# Altium schematic sheet ABS_ENC_IF.SchDoc
size 420 x 297 mm; SheetNumber: 4; PageSetup: Record=PageOptions|CenterHorizontal=False|CenterVertical=False|PrintScale=0.95|XCorrection=0.00|YCorrection=0.00|PrintKind=1|BorderSize=5000000|LeftOffset=0|BottomOffset=0|Orientation=1|PaperLength=1000|PaperWidth=1000|Scale=100|PaperSource=15|PrintQuality=600|MediaType=1|DitherType=10|PaperKind=A4|PrintScaleMode=1
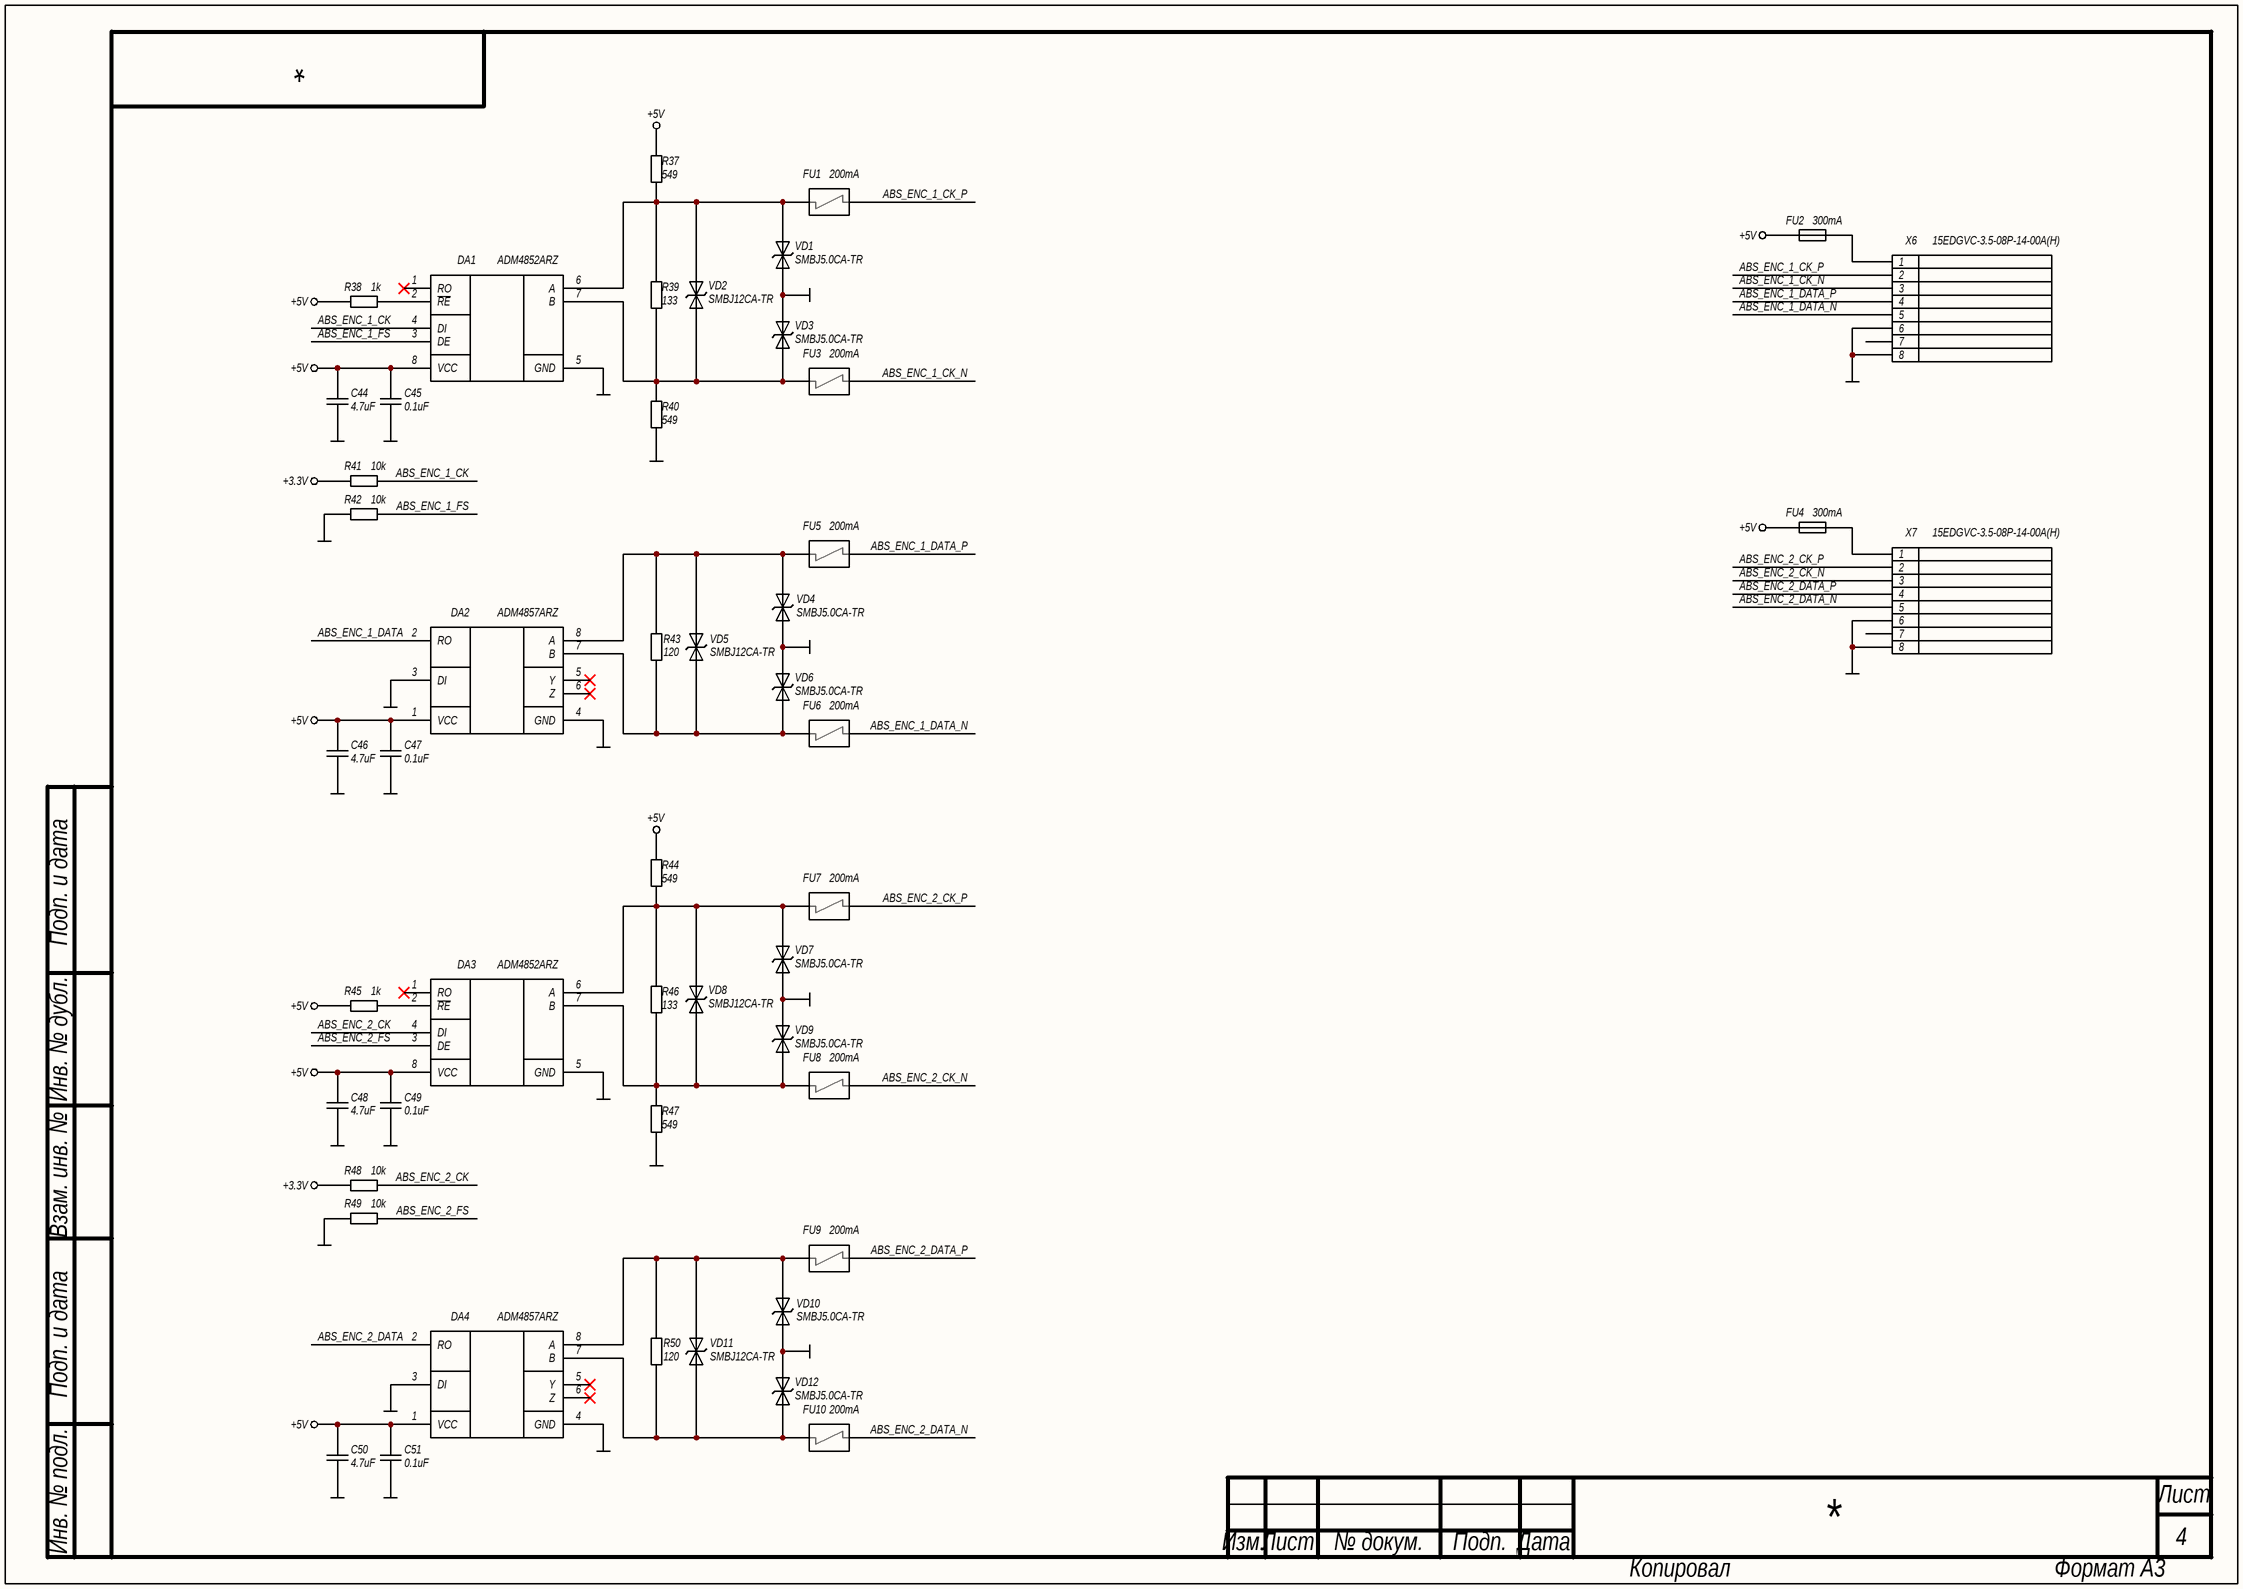
[diagram p0: ABS_ENC_IF.SchDoc]

## Parts
C44  4.7uF  [C0603N]
C45  0.1uF  [C0603N]
C46  4.7uF  [C0603N]
C47  0.1uF  [C0603N]
C48  4.7uF  [C0603N]
C49  0.1uF  [C0603N]
C50  4.7uF  [C0603N]
C51  0.1uF  [C0603N]
DA1  ADM4852ARZ  [SOIC8]
DA2  ADM4857ARZ  [SOIC8]
DA3  ADM4852ARZ  [SOIC8]
DA4  ADM4857ARZ  [SOIC8]
FU1  200mA  [TBU-CA]
FU2  300mA  [MF-MSMF]
FU3  200mA  [TBU-CA]
FU4  300mA  [MF-MSMF]
FU5  200mA  [TBU-CA]
FU6  200mA  [TBU-CA]
FU7  200mA  [TBU-CA]
FU8  200mA  [TBU-CA]
FU9  200mA  [TBU-CA]
FU10  200mA  [TBU-CA]
R37  549  [R0805N]
R38  1k  [R0603N]
R39  133  [R0805N]
R40  549  [R0805N]
R41  10k  [R0603N]
R42  10k  [R0603N]
R43  120  [R0805N]
R44  549  [R0805N]
R45  1k  [R0603N]
R46  133  [R0805N]
R47  549  [R0805N]
R48  10k  [R0603N]
R49  10k  [R0603N]
R50  120  [R0805N]
VD1  SMBJ5.0CA-TR  [SMB]
VD2  SMBJ12CA-TR  [SMB]
VD3  SMBJ5.0CA-TR  [SMB]
VD4  SMBJ5.0CA-TR  [SMB]
VD5  SMBJ12CA-TR  [SMB]
VD6  SMBJ5.0CA-TR  [SMB]
VD7  SMBJ5.0CA-TR  [SMB]
VD8  SMBJ12CA-TR  [SMB]
VD9  SMBJ5.0CA-TR  [SMB]
VD10  SMBJ5.0CA-TR  [SMB]
VD11  SMBJ12CA-TR  [SMB]
VD12  SMBJ5.0CA-TR  [SMB]
X6  15EDGVC-3.5-08P-14-00A(H)  [15EDGVC-3.5-08P-14-00A(H)]
X7  15EDGVC-3.5-08P-14-00A(H)  [15EDGVC-3.5-08P-14-00A(H)]

## Nets
+3.3V: R41.2 R48.2
+5V: C44.2 C45.2 C46.2 C47.2 C48.2 C49.2 C50.2 C51.2 DA1.8(VCC) DA2.1(VCC) DA3.8(VCC) DA4.1(VCC) FU2.1 FU4.1 R37.2 R38.2 R44.2 R45.2
GND: C44.1 C45.1 C46.1 C47.1 C48.1 C49.1 C50.1 C51.1 DA1.5(GND) DA2.3(DI) DA2.4(GND) DA3.5(GND) DA4.3(DI) DA4.4(GND) R40.1 R42.2 R47.1 R49.2 VD1.2(A2) VD3.2(A2) VD4.2(A2) VD6.2(A2) VD7.2(A2) VD9.2(A2) VD10.2(A2) VD12.2(A2) X6.6 X6.8 X7.6 X7.8
ABS_ENC_1_CK: DA1.4(DI) R41.1
ABS_ENC_1_CK_N: FU3.3(IN/OUT) X6.3
ABS_ENC_1_CK_P: FU1.3(IN/OUT) X6.2
ABS_ENC_1_DATA: DA2.2(RO)
ABS_ENC_1_DATA_N: FU6.3(IN/OUT) X6.5
ABS_ENC_1_DATA_P: FU5.3(IN/OUT) X6.4
ABS_ENC_1_FS: DA1.3(DE) R42.1
ABS_ENC_2_CK: DA3.4(DI) R48.1
ABS_ENC_2_CK_N: FU8.3(IN/OUT) X7.3
ABS_ENC_2_CK_P: FU7.3(IN/OUT) X7.2
ABS_ENC_2_DATA: DA4.2(RO)
ABS_ENC_2_DATA_N: FU10.3(IN/OUT) X7.5
ABS_ENC_2_DATA_P: FU9.3(IN/OUT) X7.4
ABS_ENC_2_FS: DA3.3(DE) R49.1
NetDA1_2: DA1.2(~{RE}) R38.1
NetDA1_6: DA1.6(A) FU1.1(IN/OUT) R37.1 R39.2 VD1.1(A1) VD2.1(A1)
NetDA1_7: DA1.7(B) FU3.1(IN/OUT) R39.1 R40.2 VD2.2(A2) VD3.1(A1)
NetDA2_7: DA2.7(B) FU6.1(IN/OUT) R43.2 VD5.2(A2) VD6.1(A1)
NetDA2_8: DA2.8(A) FU5.1(IN/OUT) R43.1 VD4.1(A1) VD5.1(A1)
NetDA3_2: DA3.2(~{RE}) R45.1
NetDA3_6: DA3.6(A) FU7.1(IN/OUT) R44.1 R46.2 VD7.1(A1) VD8.1(A1)
NetDA3_7: DA3.7(B) FU8.1(IN/OUT) R46.1 R47.2 VD8.2(A2) VD9.1(A1)
NetDA4_7: DA4.7(B) FU10.1(IN/OUT) R50.2 VD11.2(A2) VD12.1(A1)
NetDA4_8: DA4.8(A) FU9.1(IN/OUT) R50.1 VD10.1(A1) VD11.1(A1)
NetFU2_2: FU2.2 X6.1
NetFU4_2: FU4.2 X7.1

Not connected (* = marked no-connect by the designer): DA1 1(RO)*; DA2 5(Y)* 6(Z)*; DA3 1(RO)*; DA4 5(Y)* 6(Z)*; X6 7; X7 7

## Notes on the sheet
- Подп. и дата
- Инв. № дубл.
- Взам. инв. №
- Инв. № подл.
- Лист
- Изм.
- № докум.
- Подп.
- Дата
- Копировал
- Формат А3

## Library data of the parts
C44 C46 C48 C50 = CL10A475KO8NNNC: Конденсатор; Точность: 10%; Напряжение: 16V; Диэлектрик: X5R; Производитель: Samsung Electro-Mechanics; Описание: 4.7 µF ±10% 16V Ceramic Capacitor X5R 0603 (1608 Metric); Корпус: 0603 (1608 Metric); Температурный диапазон: -55°C ~ 85°C; Вид монтажа: SMD; Артикул: CL10A475KO8NNNC; Номинал: 4.7uF; Строка для документации: https://mm.digikey.com/Volume0/opasdata/d220001/medias/docus/2328/CL10A475KO8NNNC_Spec.pdf; Тип элемента: Конденсатор
C45 C47 C49 C51 = CL10B104KB8NNNC: Конденсатор; Точность: 10%; Напряжение: 50V; Диэлектрик: X7R; Производитель: Samsung Electro-Mechanics; Описание: 0.1 µF ±10% 50V Ceramic Capacitor X7R 0603 (1608 Metric); Корпус: 0603 (1608 Metric); Температурный диапазон: -55°C ~ 125°C; Вид монтажа: SMD; Артикул: CL10B104KB8NNNC; Номинал: 0.1uF; Строка для документации: https://mm.digikey.com/Volume0/opasdata/d220001/medias/docus/609/CL10B104KB8NNNC_Spec.pdf; Тип элемента: Конденсатор
DA1 DA3 = ADM4852ARZ: Микросхема интерфейса RS485; Производитель: "D:\Altium\Libraries\GOST_LIBS\Libraries\IC\Analog Devices\ADM4852A.SchLib"; Описание: 1/1 Transceiver Half RS422, RS485 8-SOIC; Корпус: 8-SOIC (0.154", 3.90mm Width); Температурный диапазон: -40°C ~ 85°C; Вид монтажа: SMD; Артикул: ADM4852ARZ; Строка для документации: https://www.analog.com/media/en/technical-documentation/data-sheets/ADM4850_4851_4852_4853_4854_4855_4856_4857.pdf; Тип элемента: Микросхема
DA2 DA4 = ADM4857ARZ: Микросхема интерфейса RS485; Производитель: "D:\Altium\Libraries\GOST_LIBS\Libraries\IC\Analog Devices\ADM4852A.SchLib"; Описание: 1/1 Transceiver Full RS422, RS485 8-SOIC; Корпус: 8-SOIC (0.154", 3.90mm Width); Температурный диапазон: -40°C ~ 85°C; Вид монтажа: SMD; Артикул: ADM4857ARZ; Строка для документации: https://www.analog.com/media/en/technical-documentation/data-sheets/ADM4850_4851_4852_4853_4854_4855_4856_4857.pdf; Тип элемента: Микросхема
FU1 FU3 FU5-FU10 = TBU-CA065-200-WH: Полупроводниковый предохранитель; Напряжение: 650V; Тип: Surge Suppression IС; Производитель: Bourns Inc.; Описание: SURGE SUPP TBU 200MA 650VIMP SMD; Корпус: 6.50mm x 4.00mm; Температурный диапазон: -55°C ~ 125°C; Вид монтажа: SMD; Артикул: TBU-CA065-200-WH; Ток: 200mA; Строка для документации: https://www.bourns.com/docs/Product-Datasheets/TBU-CA.pdf; Тип элемента: Предохранитель
FU2 FU4 = MF-MSMF030-2: Плавкий предохранитель; Напряжение: 30V; Тип: PTC Resettable Fuse; Производитель: Bourns Inc.; Описание: Polymeric PTC Resettable Fuse 30V 300 mA Ih Surface Mount 1812 (4532 Metric), Concave; Корпус: 1812 (4532 Metric), Concave; Температурный диапазон: -40°C ~ 85°C; Вид монтажа: SMD; Артикул: MF-MSMF030-2; Ток: 300mA; Строка для документации: https://www.bourns.com/docs/product-datasheets/mf-msmf.pdf; Тип элемента: Предохранитель
R37 R40 R44 R47 = RC0805FR-07549RL: Резистор; Точность: 1%; ТКС: ±100ppm/°C; Напряжение: 150V; Производитель: YAGEO; Описание: 549 Ohms ±1% 0.125W, 1/8W Chip Resistor 0805 (2012 Metric) Moisture Resistant Thick Film; Корпус: 0805 (2012 Metric); Температурный диапазон: -55°C ~ 155°C; Вид монтажа: SMD; Артикул: RC0805FR-07549RL; Номинал: 549; Строка для документации: https://www.yageo.com/upload/media/product/productsearch/datasheet/rchip/PYu-RC_Group_51_RoHS_L_12.pdf; Тип элемента: Резистор
R38 R45 = RC0603FR-071KL: Резистор; Точность: 1%; ТКС: ±100ppm/°C; Напряжение: 75V; Производитель: YAGEO; Описание: 1 kOhms ±1% 0.1W, 1/10W Chip Resistor 0603 (1608 Metric) Moisture Resistant Thick Film; Корпус: 0603 (1608 Metric); Температурный диапазон: -55°C ~ 155°C; Вид монтажа: SMD; Артикул: RC0603FR-071KL; Номинал: 1k; Строка для документации: https://www.yageo.com/upload/media/product/app/datasheet/rchip/pyu-rc_group_51_rohs_l.pdf; Тип элемента: Резистор
R39 R46 = RC0805FR-07133RL: Резистор; Точность: 1%; ТКС: ±100ppm/°C; Напряжение: 150V; Производитель: YAGEO; Описание: 133 Ohms ±1% 0.125W, 1/8W Chip Resistor 0805 (2012 Metric) Moisture Resistant Thick Film; Корпус: 0805 (2012 Metric); Температурный диапазон: -55°C ~ 155°C; Вид монтажа: SMD; Артикул: RC0805FR-07133RL; Номинал: 133; Строка для документации: https://www.yageo.com/upload/media/product/productsearch/datasheet/rchip/PYu-RC_Group_51_RoHS_L_12.pdf; Тип элемента: Резистор
R41 R42 R48 R49 = RC0603FR-0710KL: Резистор; Точность: 1%; ТКС: ±100ppm/°C; Напряжение: 75V; Производитель: YAGEO; Описание: 10 kOhms ±1% 0.1W, 1/10W Chip Resistor 0603 (1608 Metric) Moisture Resistant Thick Film; Корпус: 0603 (1608 Metric); Температурный диапазон: -55°C ~ 155°C; Вид монтажа: SMD; Артикул: RC0603FR-0710KL; Номинал: 10k; Строка для документации: https://www.yageo.com/upload/media/product/app/datasheet/rchip/pyu-rc_group_51_rohs_l.pdf; Тип элемента: Резистор
R43 R50 = RC0805FR-07120RL: Резистор; Точность: 1%; ТКС: ±100ppm/°C; Напряжение: 150V; Производитель: YAGEO; Описание: 120 Ohms ±1% 0.125W, 1/8W Chip Resistor 0805 (2012 Metric) Moisture Resistant Thick Film; Корпус: 0805 (2012 Metric); Температурный диапазон: -55°C ~ 155°C; Вид монтажа: SMD; Артикул: RC0805FR-07120RL; Номинал: 120; Строка для документации: https://www.yageo.com/upload/media/product/productsearch/datasheet/rchip/PYu-RC_Group_51_RoHS_L_12.pdf; Тип элемента: Резистор
VD1 VD3 VD4 VD6 VD7 VD9 VD10 VD12 = SMBJ5.0CA-TR: TVS диод двунаправленный; Напряжение: 5V; Напряжение ограничения: 9.2V; Напряжение пробоя: 6.4V; Ток: 68A; Тип: TVS Bidirectional; Производитель: STMicroelectronics; Описание: 9.2V Clamp 68A Ipp Tvs Diode Surface Mount SMB (DO-214AA); Корпус: DO-214AA, SMB; Температурный диапазон: -55°C ~ 150°C (TJ); Вид монтажа: SMD; Тип элемента: Диод защитный; Артикул: SMBJ5.0CA-TR; Строка для документации: https://www.st.com/content/ccc/resource/technical/document/datasheet/19/78/91/39/07/cd/40/65/CD00001366.pdf/files/CD00001366.pdf/_jcr_content/translations/en.CD00001366.pdf
VD2 VD5 VD8 VD11 = SMBJ12CA-TR: TVS диод двунаправленный; Напряжение: 12V; Напряжение ограничения: 19.9V; Напряжение пробоя: 13.3V; Ток: 31A; Тип: TVS Bidirectional; Производитель: STMicroelectronics; Описание: 19.9V Clamp 31A Ipp Tvs Diode Surface Mount SMB (DO-214AA); Корпус: DO-214AA, SMB; Температурный диапазон: -55°C ~ 150°C (TJ); Вид монтажа: SMD; Тип элемента: Диод защитный; Артикул: SMBJ12CA-TR; Строка для документации: https://www.st.com/content/ccc/resource/technical/document/datasheet/19/78/91/39/07/cd/40/65/CD00001366.pdf/files/CD00001366.pdf/_jcr_content/translations/en.CD00001366.pdf
X6 X7 = 15EDGVC-3.5-08P-14-00A(H): Разъем, 8 контактов; Тип разъема: Pluggable terminal block; Количество контактов: 8; Шаг контактов: 3.5mm; Ток: 7A; Напряжение: 250V; Производитель: Degson Electronics; Описание: Pluggable terminal block; 3.5mm; ways: 8; straight; socket; male; Температурный диапазон: -40°C ~ 105°C; Вид монтажа: Through Hole; Артикул: 15EDGVC-3.5-08P-14-00A(H); Строка для документации: https://www.tme.eu/Document/83e7173fe653a2d0e44585e87978945b/opr014R8.pdf; Тип элемента: Разъем